# Altium schematic sheet V2.0.SchDoc
size 101 x 38 mm; PageSetup: Record=PageOptions|CenterHorizontal=True|CenterVertical=True|PrintScale=0.71|XCorrection=1.00|YCorrection=1.00|PrintKind=1|BorderSize=5000000|LeftOffset=0|BottomOffset=0|Orientation=2|PaperLength=1000|PaperWidth=1000|Scale=100|PaperSource=15|PrintQuality=4000|MediaType=1|DitherType=10|PrintScaleMode=1|PaperKind=A4|PaperIndex=9
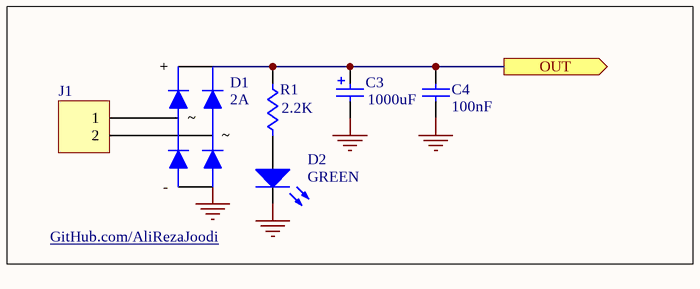
[diagram p0: V2.0.SchDoc]

## Parts
C3  1000uF  [CAPPR5-10x12.5]
C4  100nF  [CAPNTO2.54-3.05x1.78A]
D1  2A  [BRIDGE-1]
D2  GREEN  [LED-5mm_Red]
J1  Header 2  [Fonics_2PIN_1]  (value not drawn)
R1  2.2K  [AXIAL-0.4]

## Ports
OUT (out)

## Nets
GND: C3.2 C4.1 D1.1(-) D2.2(K)
OUT: C3.1 C4.2 D1.3(+) R1.1 ; port OUT
NetD1_2: D1.2 J1.2
NetD1_4: D1.4 J1.1
NetD2_1: D2.1(A) R1.2

## Notes on the sheet
- GitHub.com/AliRezaJoodi

## Library data of the parts
C3 = Cap Pol1: Polarized Capacitor (Radial); Manufacturer: Generic Components; Class I: Passive; Published: 8-Jun-2000; Revision: July-2002: Re-released for DXP Platform.; Publisher: Altium Limited; Class II: Capacitor
C4 = Cap: Capacitor; Manufacturer: Generic Components; Class I: Passive; Published: 8-Jun-2000; Revision: July-2002: Re-released for DXP Platform.; Publisher: Altium Limited; Class II: Capacitor
D1 = Bridge_1: Full Wave Diode Bridge; Manufacturer: Generic Components; Class I: Discrete; Class II: Rectifier - Bridge; Published: 8-Jun-2000; Revision: July-2002: Re-released for DXP Platform.; Publisher: Altium Limited
D2 = LED: Typical INFRARED GaAs LED; Manufacturer: Generic Components; Class I: Optoelectronic; Published: 8-Jun-2000; Revision: July-2002: Re-released for DXP Platform.; Publisher: Altium Limited; Class II: LED
J1 = Header 2: Header, 2-Pin; LatestRevisionDate: 17-Jul-2002; LatestRevisionNote: Re-released for DXP Platform.; Publisher: Altium Limited
R1 = Res1: Resistor; Manufacturer: Generic Components; Class I: Passive; Published: 8-Jun-2000; Revision: July-2002: Re-released for DXP Platform.; Publisher: Altium Limited; Class II: Resistor